# Altium project Micromodule_LoRa.PrjPcb
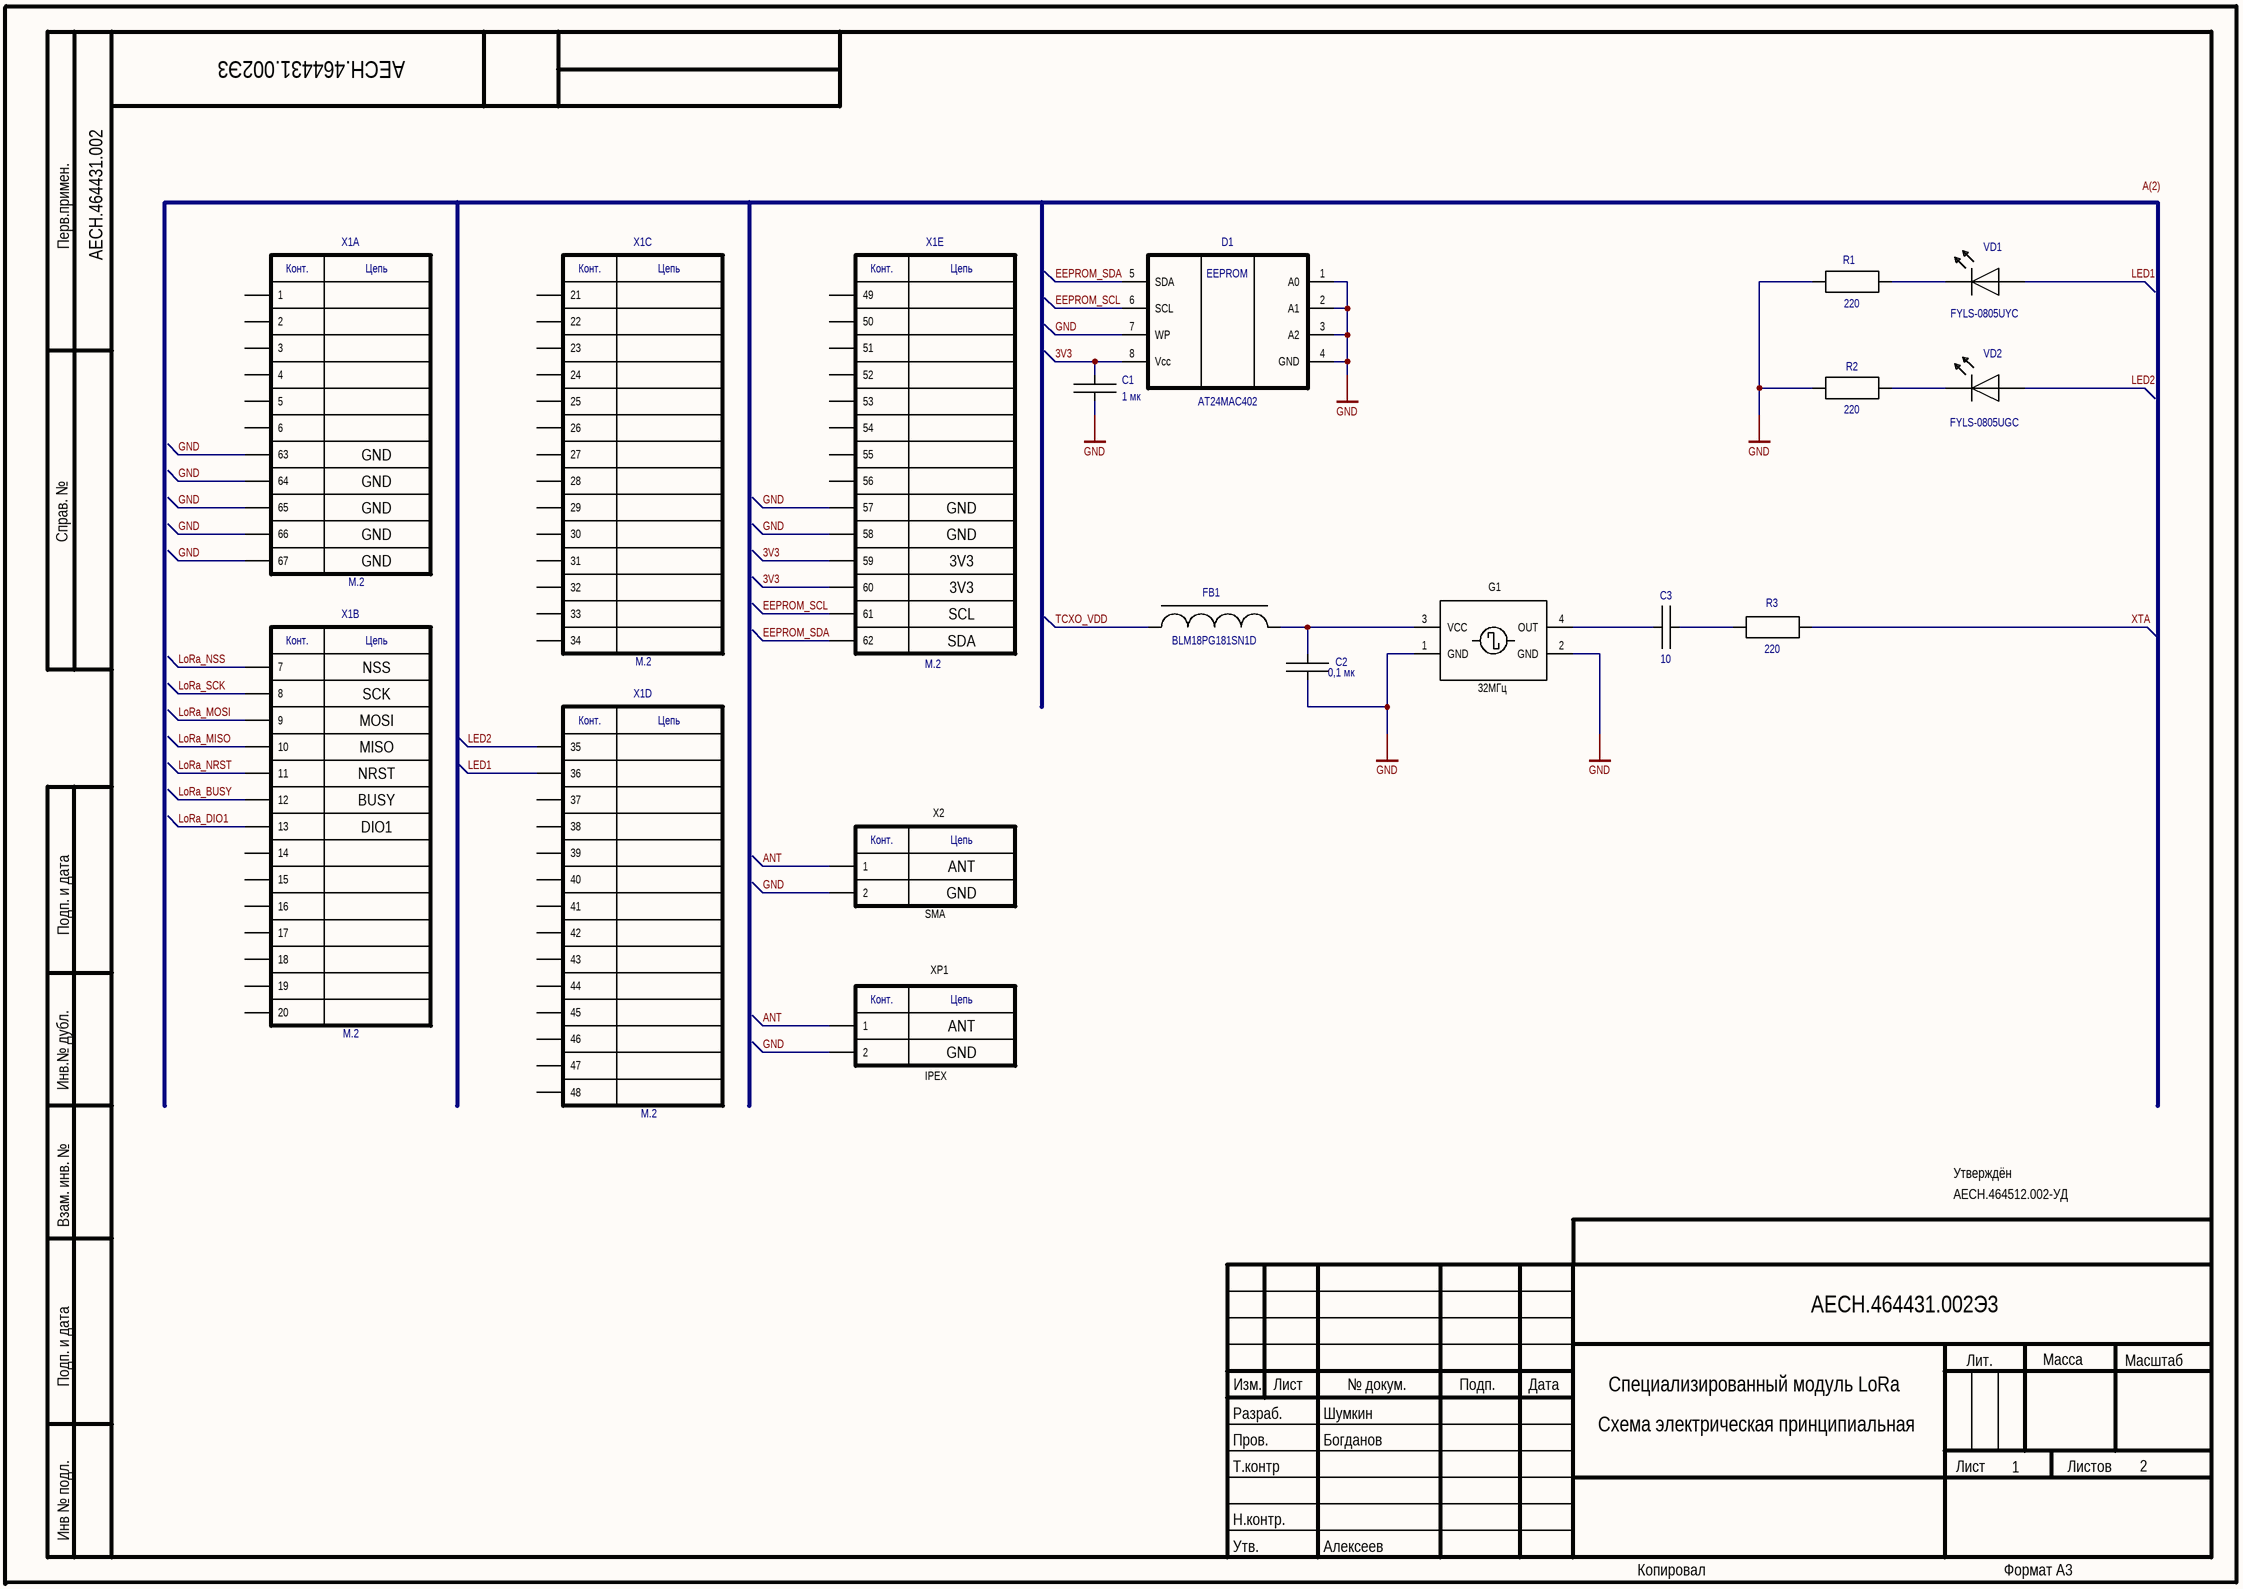
[diagram p0: Sheet1.SchDoc]
2 sheets, 43 parts. Net scope: global (net labels, ports and power ports of the same name join across sheets).
Board file: PCB2.PcbDoc
Sheets:
  Sheet1.SchDoc
  Sheet2.SchDoc

## Sheet Sheet1.SchDoc: Специализированный модуль LoRa
size 420 x 297 mm; ApprovedBy: Алексеев; CheckedBy: Богданов; Author: Шумкин; DrawnBy: Человек; DocumentNumber: АЕСН.464431.002Э3; SheetNumber: 1; SheetTotal: 2; PERVICH PRIM: АЕСН.464431.002; Title2: Схема электрическая принципиальная; DocumentName: Sheet1.SCHDOC; Application_BuildNumber: sdfsdfsdfsdfsdfs

### Parts
C1  value 1 мк  [С0603]  (hidden comment: C)
C2  value 0,1 мк  [С0603]  (hidden comment: C)
C3  value 10  [С0603]  (hidden comment: C)
D1  AT24MAC402  [SOIC8]
FB1  value BLM18PG181SN1D  [R0603]  (hidden comment: Ferrite_Beads)
G1  32МГц  [OSC_2016]
R1  value 220  [R0603]  (hidden comment: R)
R2  value 220  [R0603]  (hidden comment: R)
R3  value 220  [R0603]  (hidden comment: R)
VD1  FYLS-0805UYC  [LED_0805]
VD2  FYLS-0805UGC  [LED_0805]
X1  M.2  [M.2_edge]  (parts A,B,C,D,E of 5)
X2  SMA  [SMA_kont]
XP1  IPEX  [IPEX]

### Nets
GND: C1.2 C2.2 D1.1(A0) D1.2(A1) D1.3(A2) D1.4(GND) D1.7(WP) G1.1(GND) G1.2(GND) R1.2 R2.2 X1.57 X1.58 X1.63 X1.64 X1.65 X1.66 X1.67 X2.2 XP1.2
3V3: C1.1 D1.8(Vcc) X1.59 X1.60
ANT: X2.1 XP1.1
EEPROM_SCL: D1.6(SCL) X1.61
EEPROM_SDA: D1.5(SDA) X1.62
LED1: VD1.1 X1.36
LED2: VD2.1 X1.35
LoRa_BUSY: X1.12
LoRa_DIO1: X1.13
LoRa_MISO: X1.10
LoRa_MOSI: X1.9
LoRa_NRST: X1.11
LoRa_NSS: X1.7
LoRa_SCK: X1.8
TCXO_VDD: FB1.1
XTA: R3.2
NetC2_1: C2.1 FB1.2 G1.3(VCC)
NetC3_1: C3.1 G1.4(OUT)
NetC3_2: C3.2 R3.1
NetR1_1: R1.1 VD1.2
NetR2_1: R2.1 VD2.2

Not connected (* = marked no-connect by the designer): X1 1 2 3 4 5 6 14 15 16 17 18 19 20 21 22 23 24 25 26 27 28 29 30 31 32 33 34 37 38 39 40 41 42 43 44 45 46 47 48 49 50 51 52 53 54 55 56

### Notes on the sheet
- GND
- 3V3
- NSS
- SCL
- SDA
- SCK
- MOSI
- MISO
- NRST
- BUSY
- DIO1
- ANT
- АЕСН.464512.002-УД
- Утверждён
- Labels drawn without touching a wire or pin: A(2)
- Перв.примен.
- Справ. №
- Подп. и дата
- Инв.№ дубл.
- Взам. инв. №
- Изм.
- Лист
- № докум.
- Подп.
- Дата
- Лит.
- Масса
- Масштаб
- Пров.
- Т.контр
- Разраб.
- Листов
- Инв № подл.
- Н.контр.
- Утв.
- Копировал
- Формат А3
- (in symbol 2pin) Конт.; Цепь
- (in symbol AT24MAC402) EEPROM
- (in symbol M.2, part A) Конт.; Цепь
- (in symbol M.2, part B) Конт.; Цепь
- (in symbol M.2, part C) Конт.; Цепь
- (in symbol M.2, part D) Конт.; Цепь
- (in symbol M.2, part E) Конт.; Цепь

### Library data of the parts
C1 C2 = C: Voltage: 16 В
C3 = C: Voltage: 50 В
G1 = TCXO: Value: NT2016SA 32MHz END4263A
VD1 VD2 = VD_LED: Voltage: ?
X2 XP1 = 2pin

## Sheet Sheet2.SchDoc
size 420 x 297 mm; DocumentNumber: АЕСН.464431.002Э3; SheetNumber: 2; SheetTotal: x; DocumentName: Sheet1.SCHDOC
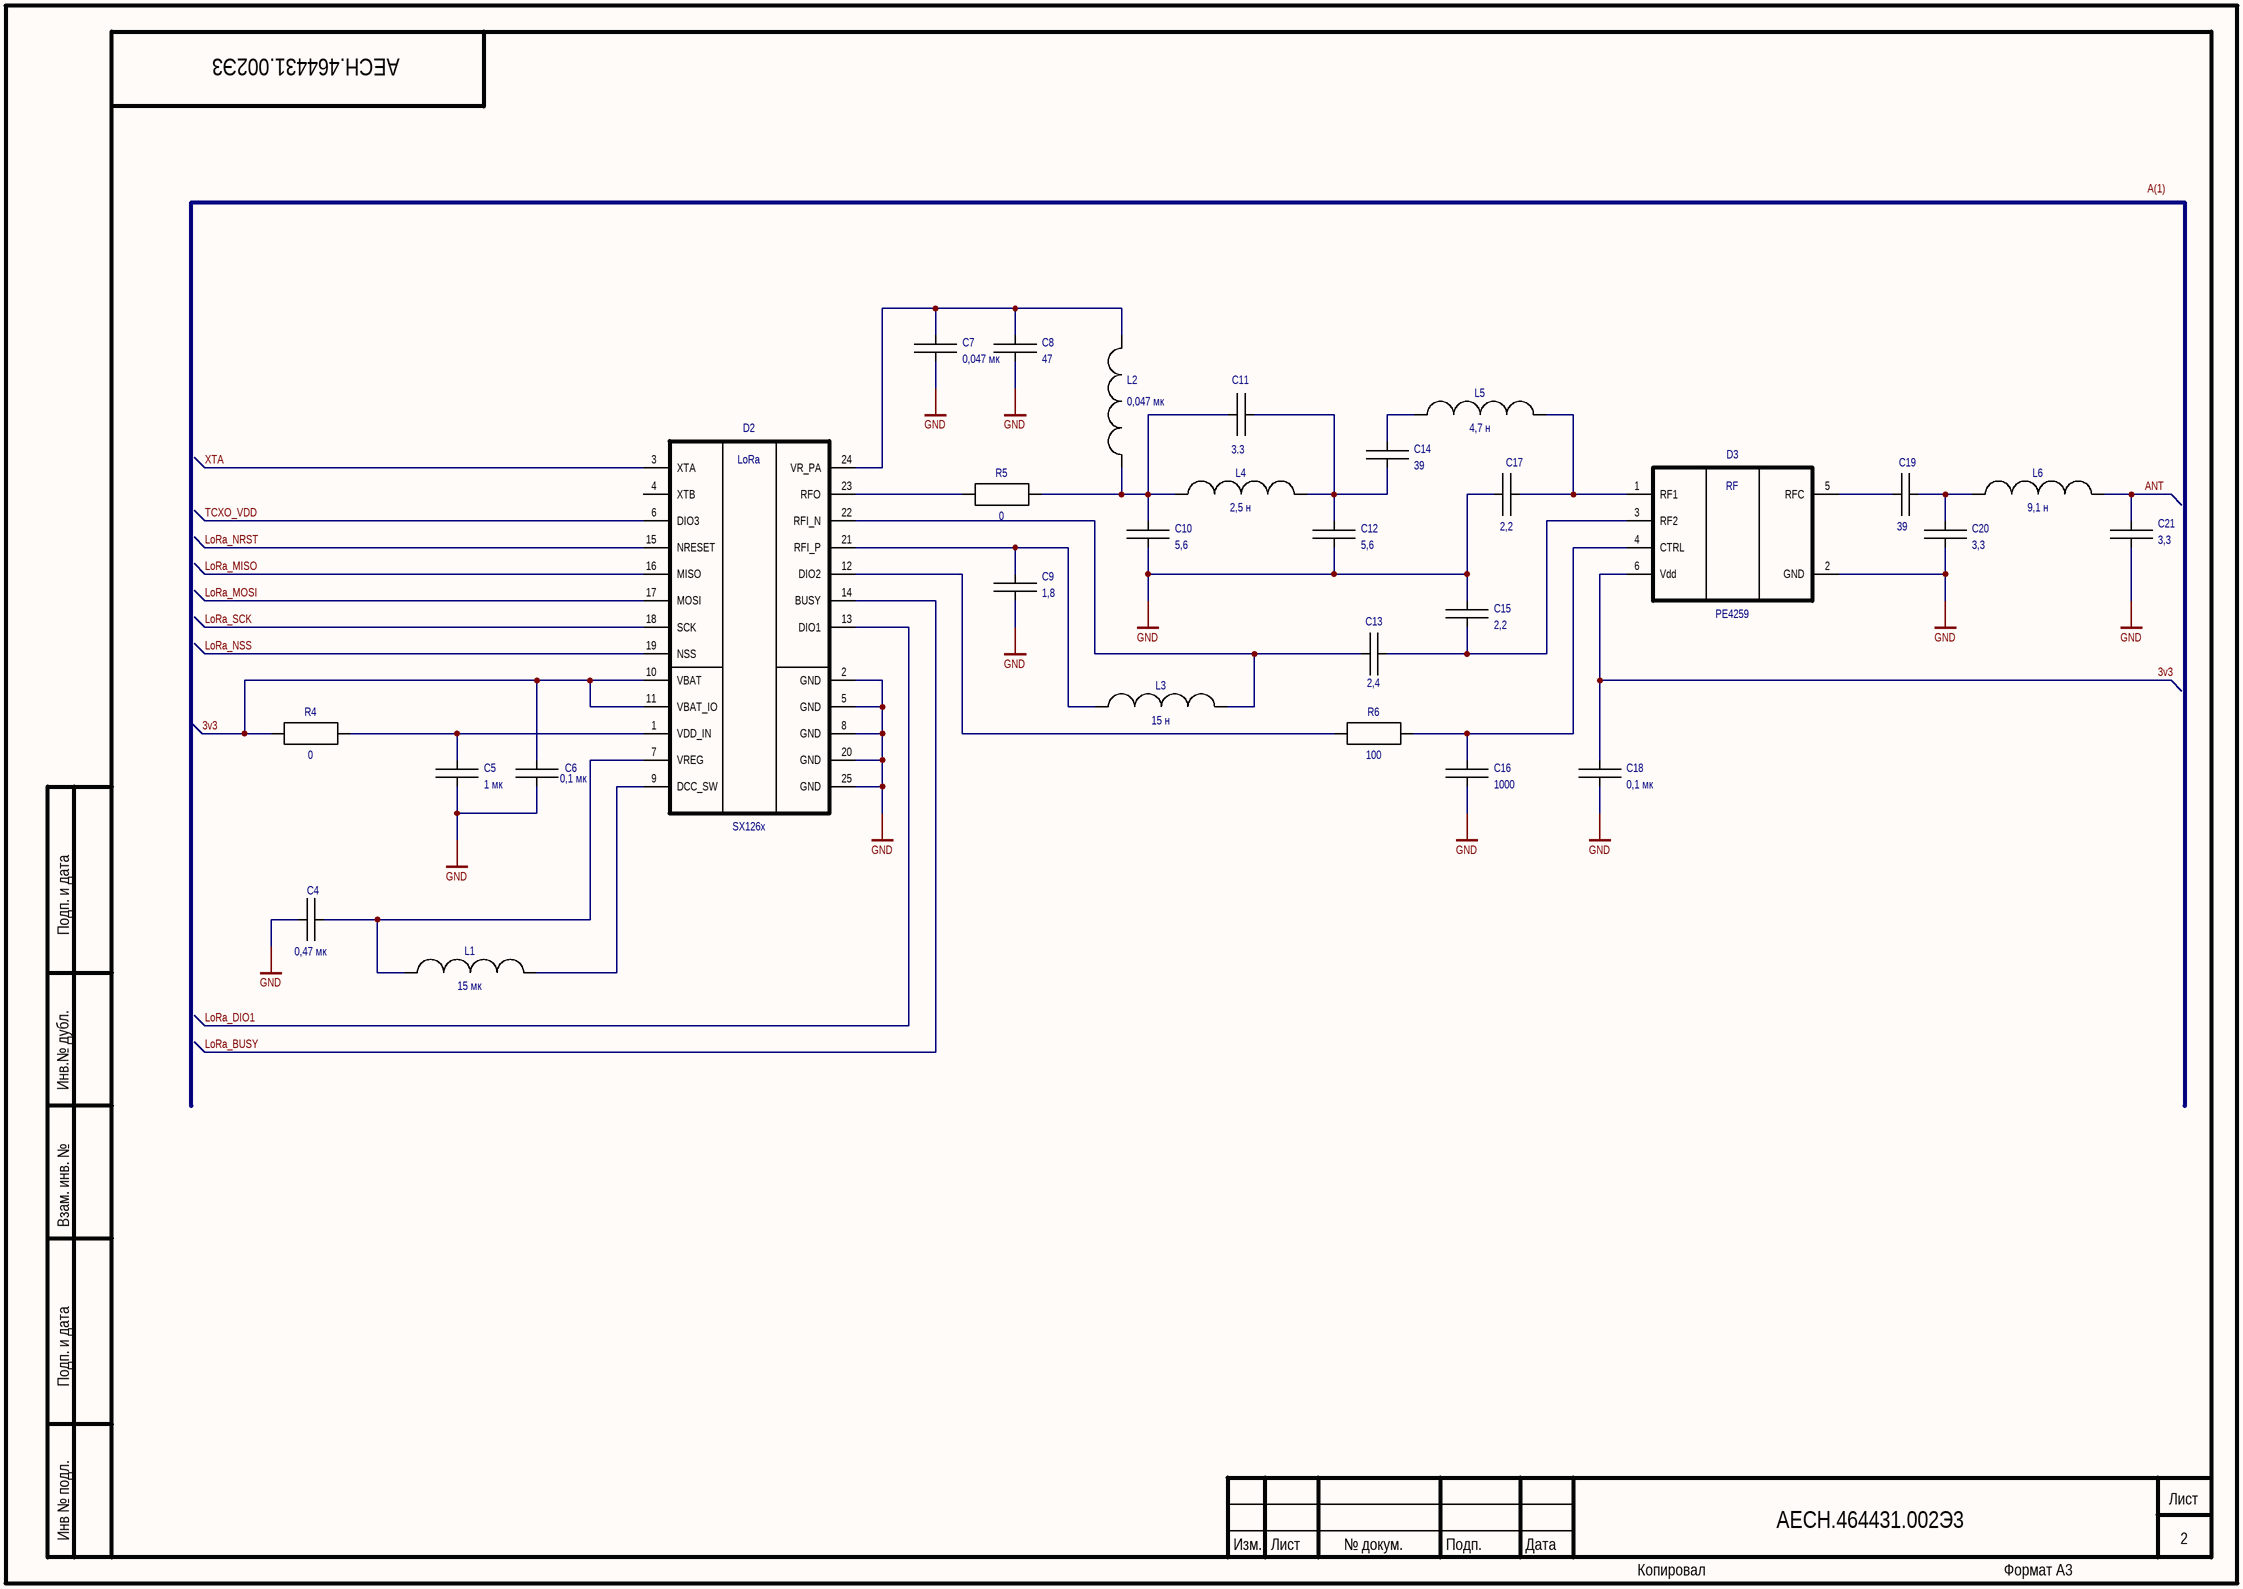
[diagram p1: Sheet2.SchDoc]

### Parts
C4  value 0,47 мк  [С0603]  (hidden comment: C)
C5  value 1 мк  [С0603]  (hidden comment: C)
C6  value 0,1 мк  [С0603]  (hidden comment: C)
C7  value 0,047 мк  [С0603]  (hidden comment: C)
C8  value 47  [С0603]  (hidden comment: C)
C9  value 1,8  [С0603]  (hidden comment: C)
C10  value 5,6  [С0603]  (hidden comment: C)
C11  value 3.3  [С0603]  (hidden comment: C)
C12  value 5,6  [С0603]  (hidden comment: C)
C13  value 2,4  [С0603]  (hidden comment: C)
C14  value 39  [С0603]  (hidden comment: C)
C15  value 2,2  [С0603]  (hidden comment: C)
C16  value 1000  [С0603]  (hidden comment: C)
C17  value 2,2  [С0603]  (hidden comment: C)
C18  value 0,1 мк  [С0603]  (hidden comment: C)
C19  value 39  [С0603]  (hidden comment: C)
C20  value 3,3  [С0603]  (hidden comment: C)
C21  value 3,3  [С0603]  (hidden comment: C)
D2  SX126x  [QFN24_4X4_SEM]
D3  PE4259  [SC70-6]
L1  value 15 мк  [IND_0805]  (hidden comment: L)
L2  value 0,047 мк  [INDC_0603]  (hidden comment: L)
L3  value 15 н  [INDC_0603]  (hidden comment: L)
L4  value 2,5 н  [INDC_0603]  (hidden comment: L)
L5  value 4,7 н  [INDC_0603]  (hidden comment: L)
L6  value 9,1 н  [INDC_0603]  (hidden comment: L)
R4  value 0  [R0603]  (hidden comment: R)
R5  value 0  [R0603]  (hidden comment: R)
R6  value 100  [R0603]  (hidden comment: R)

### Nets
GND: C4.1 C5.2 C6.2 C7.2 C8.2 C9.2 C10.2 C12.2 C15.1 C16.2 C17.1 C18.2 C20.2 C21.2 D2.2(GND) D2.5(GND) D2.8(GND) D2.20(GND) D2.25(GND) D3.2(GND)
3V3: C6.1 C18.1 D2.10(VBAT) D2.11(VBAT_IO) D3.6(Vdd) R4.1
ANT: C21.1 L6.2
LoRa_BUSY: D2.14(BUSY)
LoRa_DIO1: D2.13(DIO1)
LoRa_MISO: D2.16(MISO)
LoRa_MOSI: D2.17(MOSI)
LoRa_NRST: D2.15(NRESET)
LoRa_NSS: D2.19(NSS)
LoRa_SCK: D2.18(SCK)
TCXO_VDD: D2.6(DIO3)
XTA: D2.3(XTA)
NetC4_2: C4.2 D2.7(VREG) L1.1
NetC5_1: C5.1 D2.1(VDD_IN) R4.2
NetC7_1: C7.1 C8.1 D2.24(VR_PA) L2.2
NetC9_1: C9.1 D2.21(RFI_P) L3.1
NetC10_1: C10.1 C11.1 L2.1 L4.1 R5.2
NetC11_2: C11.2 C12.1 C14.1 L4.2
NetC13_1: C13.1 D2.22(RFI_N) L3.2
NetC13_2: C13.2 C15.2 D3.3(RF2)
NetC14_2: C14.2 L5.1
NetC16_1: C16.1 D3.4(CTRL) R6.2
NetC17_2: C17.2 D3.1(RF1) L5.2
NetC19_1: C19.1 D3.5(RFC)
NetC19_2: C19.2 C20.1 L6.1
NetD2_9: D2.9(DCC_SW) L1.2
NetD2_12: D2.12(DIO2) R6.1
NetD2_23: D2.23(RFO) R5.1

Not connected (* = marked no-connect by the designer): D2 4(XTB)

### Notes on the sheet
- Labels drawn without touching a wire or pin: A(1)
- Подп. и дата
- Инв.№ дубл.
- Взам. инв. №
- Инв № подл.
- Изм.
- Лист
- № докум.
- Подп.
- Дата
- Копировал
- Формат А3
- (in symbol PE4259) RF
- (in symbol SX126x) LoRa

### Library data of the parts
C4 C5 C16 = C: Voltage: 10 В
C6 C7 C18 = C: Voltage: 16 В
C8-C11 C13-C15 C17 C19-C21 = C: Voltage: 50 В
C12 = C: Voltage: 50

## Nets that join several sheets
GND: Sheet1 (20 pins), Sheet2 (20 pins)
3V3: Sheet1 (C1.1 D1.8 X1.59 X1.60), Sheet2 (6 pins)
ANT: Sheet1 (X2.1 XP1.1), Sheet2 (C21.1 L6.2)
LoRa_BUSY: Sheet1 (X1.12), Sheet2 (D2.14)
LoRa_DIO1: Sheet1 (X1.13), Sheet2 (D2.13)
LoRa_MISO: Sheet1 (X1.10), Sheet2 (D2.16)
LoRa_MOSI: Sheet1 (X1.9), Sheet2 (D2.17)
LoRa_NRST: Sheet1 (X1.11), Sheet2 (D2.15)
LoRa_NSS: Sheet1 (X1.7), Sheet2 (D2.19)
LoRa_SCK: Sheet1 (X1.8), Sheet2 (D2.18)
TCXO_VDD: Sheet1 (FB1.1), Sheet2 (D2.6)
XTA: Sheet1 (R3.2), Sheet2 (D2.3)